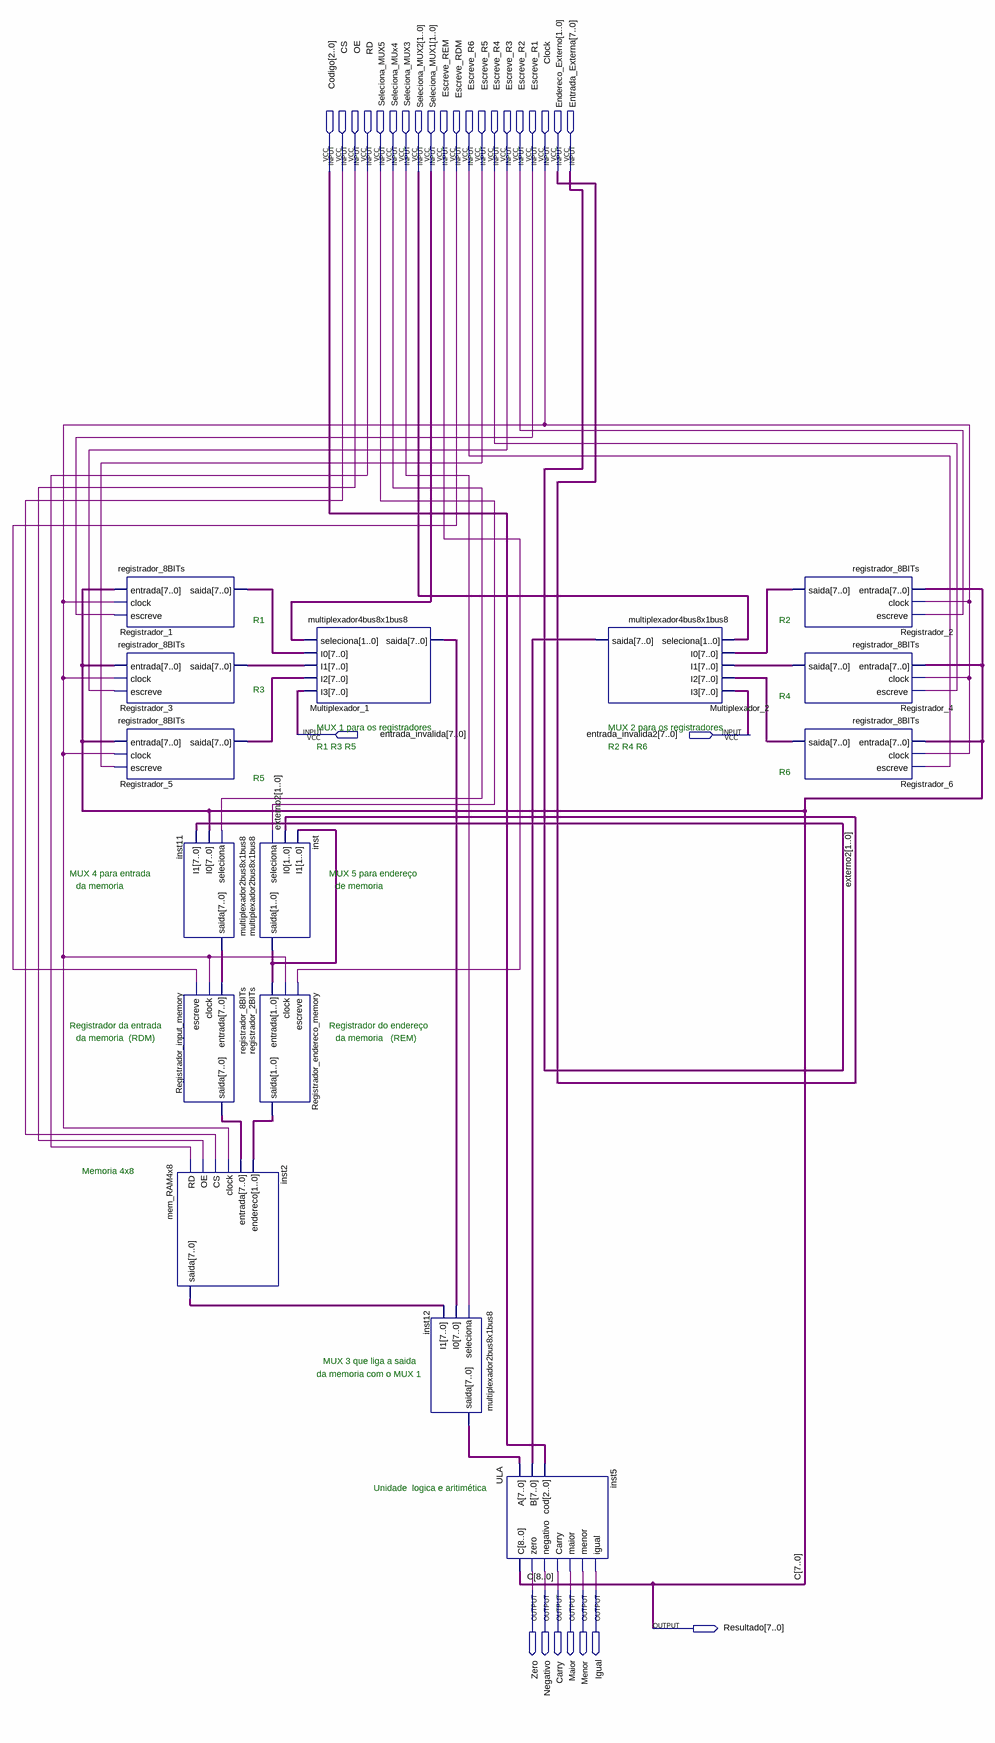
[diagram p0: schematic sheet]
// Quartus schematic CPU.bdf as structural Verilog: 15 symbols, 29 pins
module CPU (
  input  [2:0] Codigo,
  input  CS,
  input  OE,
  input  RD,
  input  Seleciona_MUX5,
  input  Seleciona_MUx4,
  input  Seleciona_MUX3,
  input  [1:0] Seleciona_MUX2,
  input  [1:0] Seleciona_MUX1,
  input  Escreve_REM,
  input  Escreve_RDM,
  input  Escreve_R6,
  input  Escreve_R5,
  input  Escreve_R4,
  input  Escreve_R3,
  input  Escreve_R2,
  input  Escreve_R1,
  input  Clock,
  input  [1:0] Endereco_Externo,
  input  [7:0] Entrada_Externa,
  input  [7:0] entrada_invalida,
  input  [7:0] entrada_invalida2,
  output Zero,
  output Negativo,
  output Carry,
  output Maior,
  output Menor,
  output Igual,
  output [7:0] Resultado
);

  wire [1:0] inst_saida, Registrador_endereco_memory_saida;
  wire [7:0] inst2_saida, inst11_saida, inst12_saida, Multiplexador_1_saida, Multiplexador_2_saida,
       Registrador_1_saida, Registrador_2_saida, Registrador_3_saida, Registrador_4_saida,
       Registrador_5_saida, Registrador_6_saida, Registrador_input_memory_saida;
  wire [8:8] C;

  registrador_8BITs Registrador_1 (
    .entrada(Resultado), .clock(Clock), .escreve(Escreve_R1), .saida(Registrador_1_saida));
  registrador_8BITs Registrador_3 (
    .entrada(Resultado), .clock(Clock), .escreve(Escreve_R3), .saida(Registrador_3_saida));
  registrador_8BITs Registrador_5 (
    .entrada(Resultado), .clock(Clock), .escreve(Escreve_R5), .saida(Registrador_5_saida));
  multiplexador2bus8x1bus8 inst11 (
    .seleciona(Seleciona_MUx4), .I0(Resultado), .I1(Entrada_Externa), .saida(inst11_saida));
  registrador_8BITs Registrador_input_memory (
    .entrada(inst11_saida), .clock(Clock), .escreve(Escreve_RDM), .saida(Registrador_input_memory_saida));
  mem_RAM4x8 inst2 (
    .RD(RD), .OE(OE), .CS(CS), .clock(Clock), .entrada(Registrador_input_memory_saida),
    .endereco(Registrador_endereco_memory_saida), .saida(inst2_saida));
  multiplexador2bus8x1bus8 inst (
    .seleciona(Seleciona_MUX5), .I0(Endereco_Externo), .I1(inst_saida), .saida(inst_saida));
  registrador_2BITs Registrador_endereco_memory (
    .entrada(inst_saida), .clock(Clock), .escreve(Escreve_REM), .saida(Registrador_endereco_memory_saida));
  multiplexador4bus8x1bus8 Multiplexador_1 (
    .seleciona(Seleciona_MUX1), .I0(Registrador_1_saida), .I1(Registrador_3_saida), .I2(Registrador_5_saida),
    .I3(entrada_invalida), .saida(Multiplexador_1_saida));
  multiplexador2bus8x1bus8 inst12 (
    .seleciona(Seleciona_MUX3), .I0(Multiplexador_1_saida), .I1(inst2_saida), .saida(inst12_saida));
  ULA inst5 (
    .A(inst12_saida), .B(Multiplexador_2_saida), .cod(Codigo), .C({C[8], Resultado}), .zero(Zero),
    .negativo(Negativo), .Carry(Carry), .maior(Maior), .menor(Menor), .igual(Igual));
  multiplexador4bus8x1bus8 Multiplexador_2 (
    .seleciona(Seleciona_MUX2), .I0(Registrador_2_saida), .I1(Registrador_4_saida), .I2(Registrador_6_saida),
    .I3(entrada_invalida2), .saida(Multiplexador_2_saida));
  registrador_8BITs Registrador_2 (
    .entrada(Resultado), .clock(Clock), .escreve(Escreve_R2), .saida(Registrador_2_saida));
  registrador_8BITs Registrador_4 (
    .entrada(Resultado), .clock(Clock), .escreve(Escreve_R4), .saida(Registrador_4_saida));
  registrador_8BITs Registrador_6 (
    .entrada(Resultado), .clock(Clock), .escreve(Escreve_R6), .saida(Registrador_6_saida));

  // Other names for the same wires on the sheet: externo2[1:0] = Endereco_Externo; C[7:0] = Resultado

  // Notes on the sheet:
  //   R1
  //   R2
  //   R3
  //   R4
  //   MUX 1 para os registradores
  //   MUX 2 para os registradores
  //   R1 R3 R5
  //   R2 R4 R6
  //   R6
  //   R5
  //   MUX 4 para entrada
  //   MUX 5 para endereço
  //   da memoria
  //   de memoria
  //   Registrador da entrada
  //   Registrador do endereço
  //   da memoria  (RDM)
  //   da memoria   (REM)
  //   Memoria 4x8
  //   MUX 3 que liga a saida
  //   da memoria com o MUX 1
  //   Unidade  logica e aritimética
endmodule
